# EAGLE design rc (EAGLE 9.1.3)
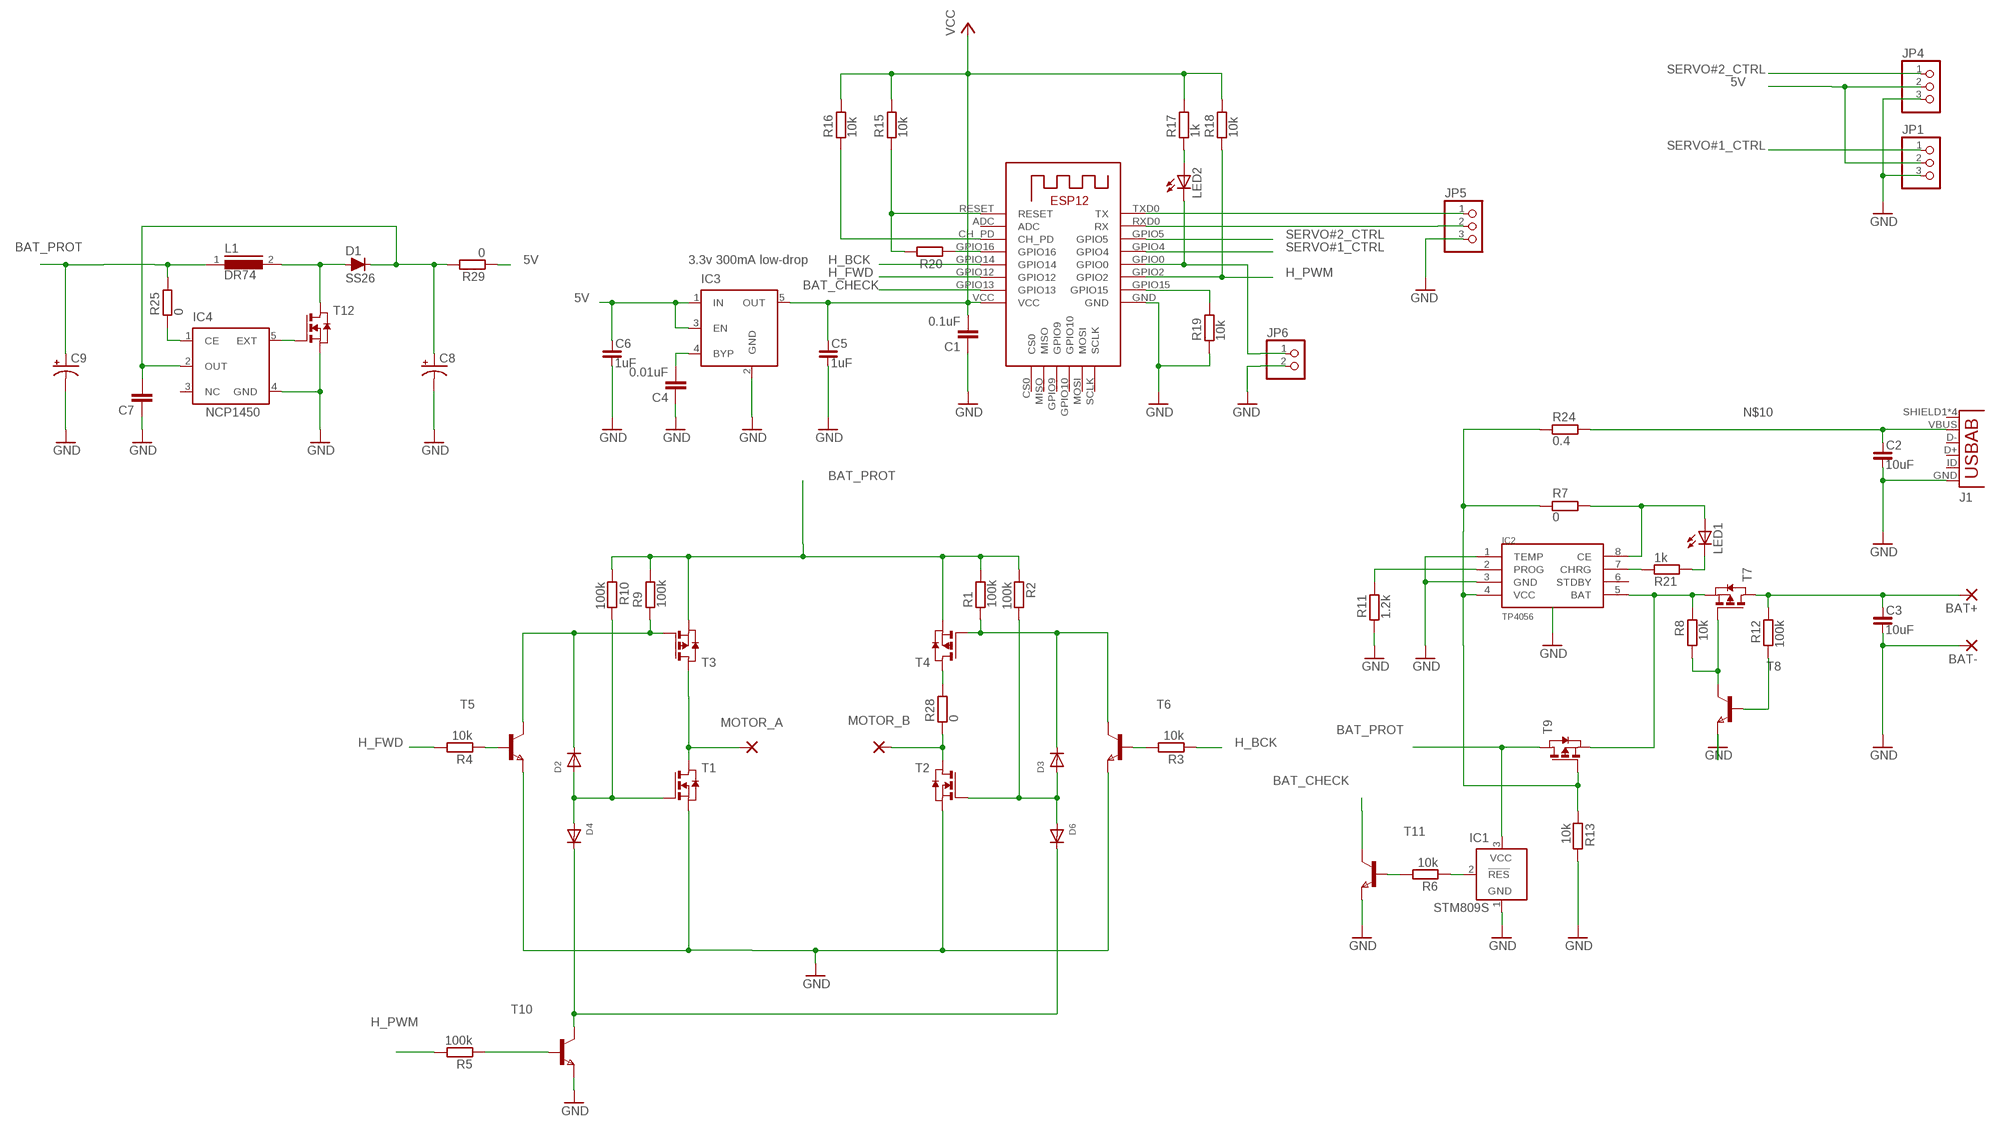
[diagram p0: schematic, sheet 1]

## Parts
BAT+  WIREPADSMD5-2,5  [5-2,5]
BAT-  WIREPADSMD5-2,5  [5-2,5]
C1  0.1uF  C-EUC0805  [C0805]
C2  10uF  C_1206  [C1206]
C3  10uF  C_1206  [C1206]
C4  0.01uF  C-EUC0805  [C0805]
C5  1uF  C_0805  [C0805]
C6  1uF  C_0805  [C0805]
C7  C-EUC0805  [C0805]
C8  CPOL-USCT6032  [CT6032]
C9  CPOL-USCT6032  [CT6032]
D1  SS26  D-FILL-SMB  [SMB]
D2  DIODE_SOD-123FL  [SOD-123FL]
D3  DIODE_SOD-123FL  [SOD-123FL]
D4  DIODE_SOD-123FL  [SOD-123FL]
D6  DIODE_SOD-123FL  [SOD-123FL]
IC1  STM809S  TCM809  [SOT23B-3]
IC2  TP4056  [SOP-8]
IC3  3.3v 300mA low-drop  MIC5219XX  [SOT23-5]
IC4  NCP1450  NCP1450A  [SOT23-5]
J1  USB-AB  [USB-AB-MICRO-SMD]
JP1  PINHD-1X3  [1X03]
JP4  PINHD-1X3  [1X03]
JP5  PINHD-1X3  [1X03]
JP6  PINHD-1X2  [1X02]
L1  DR74  [DR74]
LED1  LEDCHIPLED_0805  [CHIPLED_0805]
LED2  LEDCHIPLED_0805  [CHIPLED_0805]
MOTOR_A  WIREPADSMD5-2,5  [5-2,5]
MOTOR_B  WIREPADSMD5-2,5  [5-2,5]
R1  100k  R_0805  [R0805]
R2  100k  R_08050805  [R0805]
R3  10k  R_0805  [R0805]
R4  10k  R_0805  [R0805]
R5  100k  R_0805  [R0805]
R6  10k  R_0805  [R0805]
R7  0  R_1206  [R1206]
R8  10k  R_0805  [R0805]
R9  100k  R_0805  [R0805]
R10  100k  R_0805  [R0805]
R11  1.2k  R_0805  [R0805]
R12  100k  R_0805  [R0805]
R13  10k  R_0805  [R0805]
R15  10k  R_0805  [R0805]
R16  10k  R_0805  [R0805]
R17  1k  R_0805  [R0805]
R18  10k  R_0805  [R0805]
R19  10k  R_0805  [R0805]
R20  R_0805  [R0805]
R21  1k  R_0805  [R0805]
R24  0.4  R_1206  [R1206]
R25  0  R_1206  [R1206]
R28  0  R_1206  [R1206]
R29  0  R_1206  [R1206]
T1  NMOSSOT23  [SOT-23]
T2  NMOSSOT23  [SOT-23]
T3  PMOSSOT23  [SOT-23]
T4  PMOSSOT23  [SOT-23]
T5  NPNSOT23  [SOT-23]
T6  NPNSOT23  [SOT-23]
T7  PMOSSOT23  [SOT-23]
T8  NPNSOT23  [SOT-23]
T9  PMOSSOT23  [SOT-23]
T10  NPNSOT23  [SOT-23]
T11  NPNSOT23  [SOT-23]
T12  NMOSSOT23  [SOT-23]
U1  ESP-12  [ESP-12]

## Nets
5V: C6.1 IC3.1(IN) IC3.3(EN) JP1.2 JP4.2 R29.1
BAT+: BAT+.1(P) C3.1 R12.1 T7.1(D)
BAT_CHECK: T11.1(C) U1.GPIO13
BAT_CHRG: IC2.5(BAT) R8.1 T7.2(S) T9.2(S)
BAT_PROT: C9.+ IC1.3(VCC) L1.1 R1.2 R2.1 R9.2 R10.1 R25.2 T3.2(S) T4.2(S) T9.1(D)
GND: BAT-.1(P) C1.1 C2.2 C3.2 C4.1 C5.2 C6.2 C7.1 C8.- C9.- IC1.1(GND) IC2.1(TEMP) IC2.3(GND) IC2.HEATSINK IC3.2(GND) IC4.4(GND) J1.GND JP1.3 JP4.3 JP5.3 JP6.2 R11.2 R13.2 R19.1 T1.2(S) T2.2(S) T5.2(E) T6.2(E) T8.2(E) T10.2(E) T11.2(E) T12.2(S) U1.GND
H_BCK: R3.1 U1.GPIO14
H_FWD: R4.2 U1.GPIO12
H_PWM: R5.2 R18.1 U1.GPIO2
N$1: D2.C R9.1 T3.3(G) T5.1(C)
N$2: IC2.8(CE) LED1.A R7.2
N$3: D1.2(A) L1.2 T12.1(D)
N$4: MOTOR_B.1(P) R28.1 T2.1(D)
N$5: R4.1 T5.3(B)
N$6: D2.A D4.A R10.2 T1.3(G)
N$7: R3.2 T6.3(B)
N$8: D3.C R1.1 T4.3(G) T6.1(C)
N$9: D3.A D6.A R2.2 T2.3(G)
N$10: C2.1 J1.VBUS R24.2
N$11: IC2.2(PROG) R11.1
N$12: R8.2 T7.3(G) T8.1(C)
N$13: R6.2 T11.3(B)
N$14: R28.2 T4.1(D)
N$15: IC4.5(EXT) T12.3(G)
N$16: R12.2 T8.3(B)
N$17: IC1.2(!RES) R6.1
N$18: IC4.1(CE) R25.1
N$19: R15.1 R20.2 U1.RESET
N$20: R16.1 U1.CH_PD
N$21: JP6.1 LED2.C U1.GPIO0
N$23: R20.1 U1.GPIO16
N$24: LED2.A R17.1
N$25: C4.2 IC3.4(BYP)
N$26: R19.2 U1.GPIO15
N$27: LED1.C R21.2
N$28: IC2.7(CHRG) R21.1
N$29: C7.2 C8.+ D1.1(C) IC4.2(OUT) R29.2
N$31: D4.C D6.C T10.1(C)
N$32: R5.1 T10.3(B)
N$36: MOTOR_A.1(P) T1.1(D) T3.1(D)
RX: JP5.2 U1.RXD0(RX)
SERVO#1_CTRL: JP1.1 U1.GPIO4
SERVO#2_CTRL: JP4.1 U1.GPIO5
TX: JP5.1 U1.TXD0(TX)
V_CHRG: IC2.4(VCC) R7.1 R13.1 R24.1 T9.3(G)
VCC: C1.2 C5.1 IC3.5(OUT) R15.2 R16.2 R17.2 R18.2 U1.VCC
Unconnected: IC2.6(STDBY) IC4.3(NC) J1.D+ J1.D- J1.ID(USBID) J1.SHIELD1(SHIELD) J1.SHIELD2(SHIELD) J1.SHIELD3(SHIELD) J1.SHIELD4(SHIELD) U1.ADC U1.CS0 U1.GPIO9 U1.GPIO10 U1.MISO U1.MOSI U1.SCLK

## Library data of the parts
BAT+ BAT- MOTOR_A MOTOR_B = wirepad:WIREPAD: Wire PAD connect wire on PCB
C1 C4 C7 = skydrop:C-EU: CAPACITOR, European symbol
C2 C3 C5 C6 = skydrop:C_: NON-POLARIZED CAP
C8 C9 = adafruit:CPOL-US: POLARIZED CAPACITOR, American symbol
D1 = semicon-smd-ipc:D-FILL-: DIODE filled
D2-D4 D6 = skydrop:DIODE: Diode SMADIODE - SMA Surface Mount Package 20V 1A Schottky Diode Digikey: 641-1014-6-ND DO-1N4148 - Through Hole Small Current Diode SOD-123 20V 1 A (.5mV Vf) Schottky Diode - Digikey: MBRX120TPMSCT-ND SOD-323 10V 570mA (.38mV Vf, 3ns) Schottky Diode - Digikey: ZLLS410CT-ND SOD-523 30V 30mA Schottky Diode (RB751S-40TE61) - Digikey: RB751S-40TE61CT-ND SOT23-R/W - SOT23 Package (R = Solder Paste/Reflow Ovens, W = Hand-Soldering) BAT54Film 40V 300mA - Digikey: 497-7162-1-ND
IC1 = skydrop:TCM809: POWER SUPPLY MONITOR replacement for Maxim MAX809 and MAX810; MF: MICROCHIP; MPN: TCM809MENB713; OC_FARNELL: 9762744; OC_NEWARK: 96K3998
IC2 = my:TP4056
IC3 = skydrop:MIC5219XX: VOLTAGE REGULATOR; OC_FARNELL: unknown; OC_NEWARK: unknown
IC4 = my:NCP1450A: VOLTAGE REGULATOR; OC_FARNELL: unknown; OC_NEWARK: unknown
J1 = skydrop:USB-AB: This is a USB AB connector that is compatible with USB OTG. i.e. this connector can serve as a host or device
JP1 JP4 JP5 = my:PINHD-1X3: PIN HEADER
JP6 = my:PINHD-1X2: PIN HEADER
L1 = inductors:DR74: High Power Density, High Efficiency, Shielded Inductors Source: coiltronics_dr_series.pdf; SPICEPREFIX: L
LED1 LED2 = led:LED: LED OSRAM: - CHIPLED LG R971, LG N971, LY N971, LG Q971, LY Q971, LO R971, LY R971 LH N974, LH R974 LS Q976, LO Q976, LY Q976 LO Q996 - Hyper CHIPLED LW Q18S LB Q993, LB Q99A, LB R99A - SideLED LS A670, LO A670, LY A670, LG A670, LP A670 LB A673, LV A673, LT A673, LW A673 LH A674 LY A675 LS A676, LA A676, LO A676, LY A676, LW A676 LS A679, LY A679, LG A679 - Hyper Micro SIDELED® LS Y876, LA Y876, LO Y876, LY Y876 LT Y87S - SmartLED LW L88C, LW L88S LB L89C, LB L89S, LG L890 LS L89K, LO L89K, LY L89K LS L896, LA L896, LO L896, LY L896 - TOPLED LS T670, LO T670, LY T670, LG T670, LP T670 LSG T670, LSP T670, LSY T670, LOP T670, LYG T670 LG T671, LOG T671, LSG T671 LB T673, LV T673, LT T673, LW T673 LH T674 LS T676, LA T676, LO T676, LY T676, LB T676, LH T676, LSB T676, LW T676 LB T67C, LV T67C, LT T67C, LS T67K, LO T67K, LY T67K, LW E67C LS E67B, LA E67B, LO E67B, LY E67B, LB E67C, LV E67C, LT E67C LW T67C LS T679, LY T679, LG T679 LS T770, LO T770, LY T770, LG T770, LP T770 LB T773, LV T773, LT T773, LW T773 LH T774 LS E675, LA E675, LY E675, LS T675 LS T776, LA T776, LO T776, LY T776, LB T776 LHGB T686 LT T68C, LB T68C - Hyper Mini TOPLED® LB M676 - Mini TOPLED Santana® LG M470 LS M47K, LO M47K, LY M47K Source: http://www.osram.convergy.de LUXEON: - LUMILED® LXK2-PW12-R00, LXK2-PW12-S00, LXK2-PW14-U00, LXK2-PW14-V00 LXK2-PM12-R00, LXK2-PM12-S00, LXK2-PM14-U00 LXK2-PE12-Q00, LXK2-PE12-R00, LXK2-PE12-S00, LXK2-PE14-T00, LXK2-PE14-U00 LXK2-PB12-K00, LXK2-PB12-L00, LXK2-PB12-M00, LXK2-PB14-N00, LXK2-PB14-P00, LXK2-PB14-Q00 LXK2-PR12-L00, LXK2-PR12-M00, LXK2-PR14-Q00, LXK2-PR14-R00 LXK2-PD12-Q00, LXK2-PD12-R00, LXK2-PD12-S00 LXK2-PH12-R00, LXK2-PH12-S00 LXK2-PL12-P00, LXK2-PL12-Q00, LXK2-PL12-R00 Source: www.luxeon.com KINGBRIGHT: KA-3528ASYC Source: www.kingbright.com
R1 R3-R13 R15-R21 R24 R25 R28 R29 = skydrop:R_: RESISTOR
R2 = my:R_0805: RESISTOR
T1 T2 T12 = zetex:NMOSSOT23: MOS FET; OC_FARNELL: unknown; OC_NEWARK: unknown
T3 T4 T7 T9 = zetex:PMOSSOT23: MOS FET; OC_FARNELL: unknown; OC_NEWARK: unknown
T5 T6 T8 T10 T11 = zetex:NPNSOT23: NPN TRANSISTOR; MPN: DSS20201L-7; OC_FARNELL: 1710688; OC_NEWARK: 25R4555
U1 = my:ESP-12

## Board
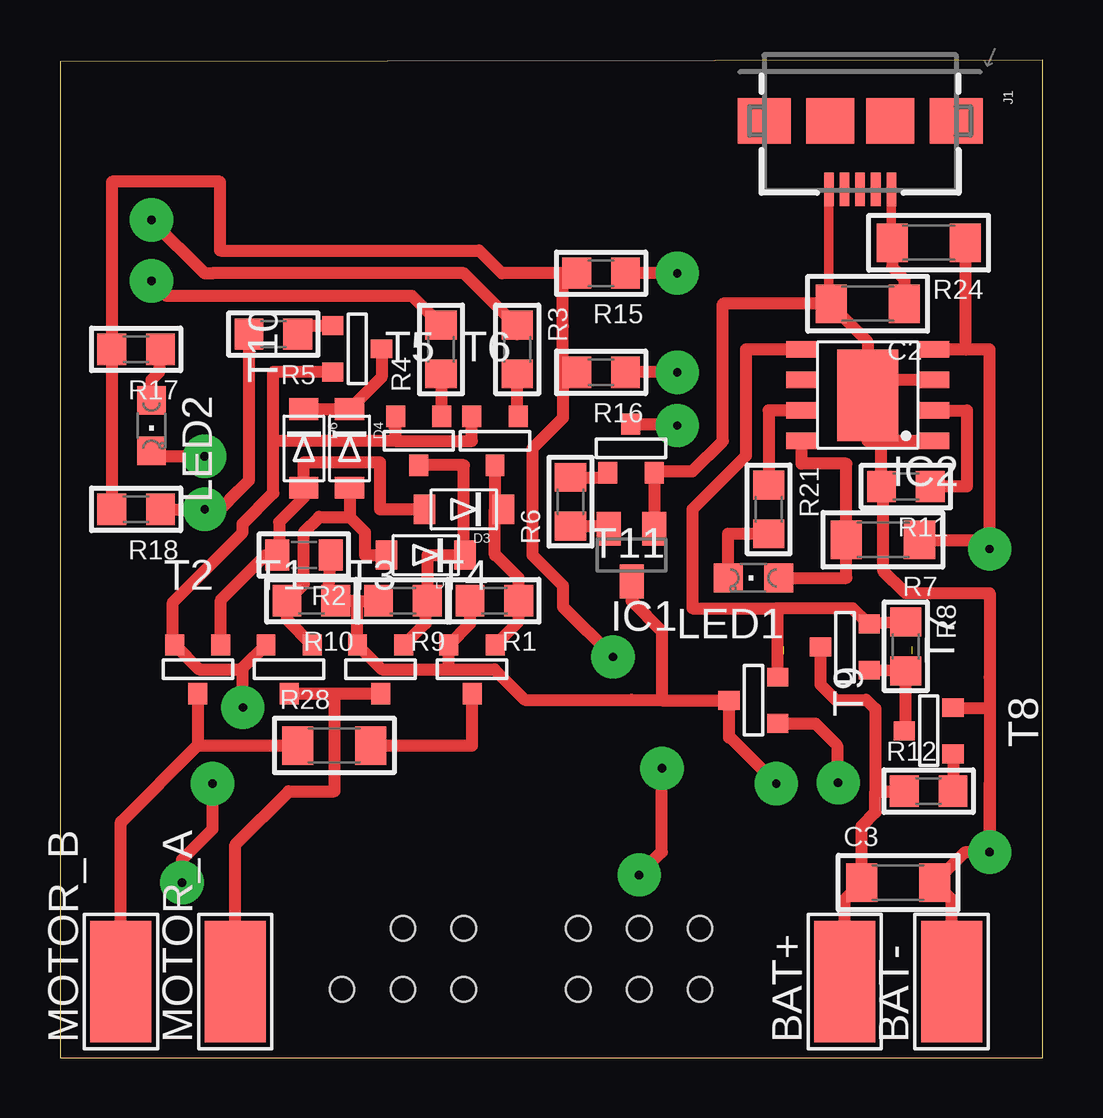
[diagram p1: board, top side]
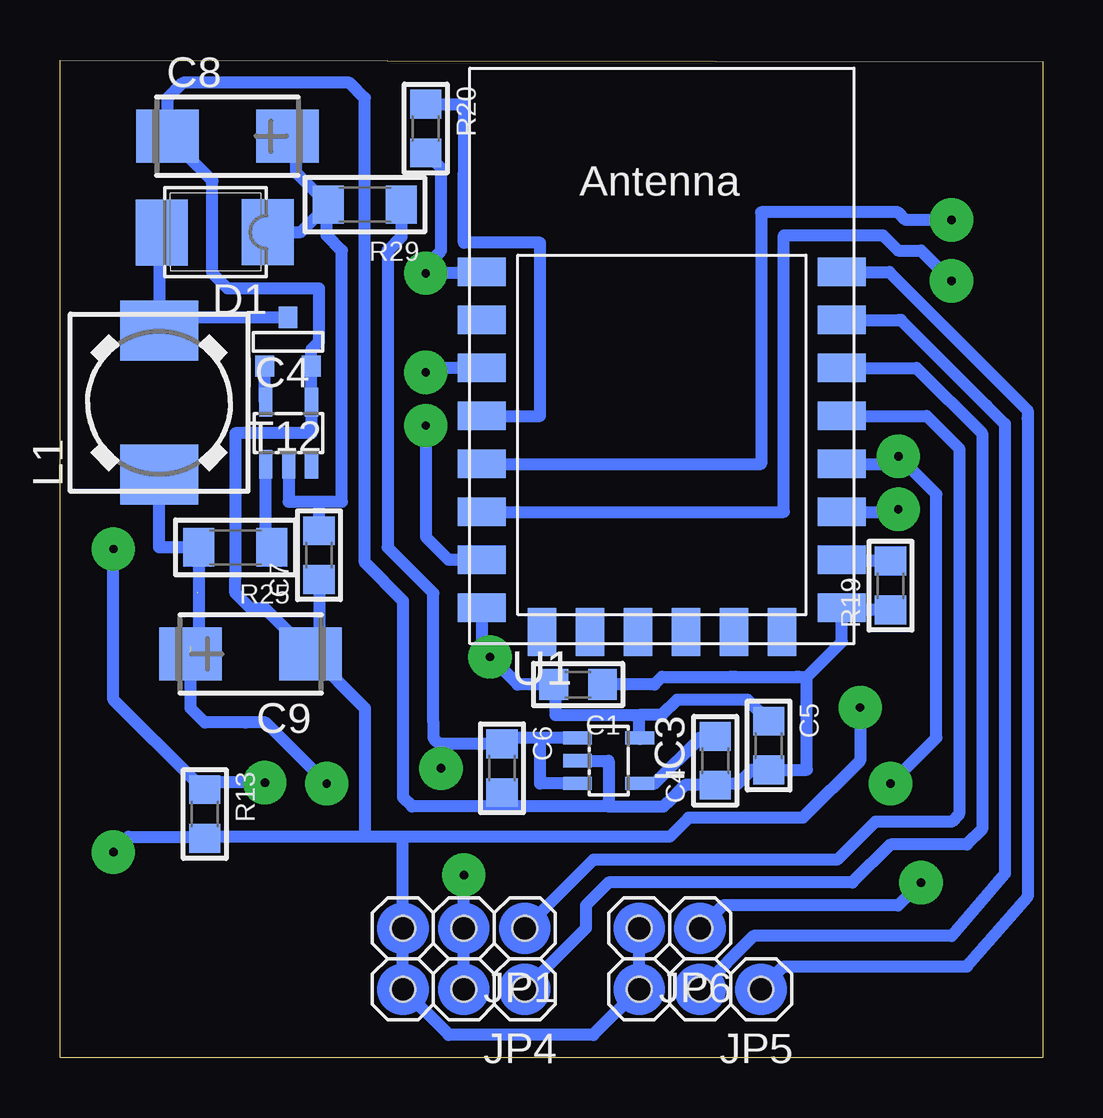
[diagram p2: board, bottom side, seen from below]

Size 40.96 x 41.59 mm. Coordinates in mm from the lower left corner, seen from the top.
Outline: 0,0 40.95,0 40.96,41.59 0,41.53 0,0
Copper layers (1*16): Top 0.035mm / dielectric 1.5mm / Bottom 0.035mm
Design rules "default *": minimum track width 0.4mm, minimum drill 0.35mm, track to track 0.4mm, track to pad 0.4mm, pad to pad 0.4mm, via to via 0.4mm, smd to smd 0.4mm, copper to edge 0.2mm, drill to drill 6mil, minimum pad ring 10mil, minimum via ring 8mil, stop-mask expansion 4mil, vias tented up to drill 0mil, thermal gap 10mil

### Footprints (pad centres in the part's own frame; a part is rotated, then mirrored left to right if it is on the bottom)
5-2,5 = smd 2.54 x 5.08: 1 0,0
C0805 = smd 1.2 x 1.3: 1 -1.016,0; 2 1.016,0
C1206 = smd 1.3 x 1.6: 1 -1.524,0; 2 1.524,0
CT6032 = smd 2.6 x 2.2: + 2.5,0; - -2.5,0
SMB = smd 2.159 x 2.743: 1 -2.311,-0.127; 2 2.108,-0.102
SOD-123FL = smd 0.91 x 1.22: A 1.637,0; C -1.637,0
SOT23B-3 = smd 1 x 1.4: 1 -0.95,-1.1; 2 0.95,-1.1; 3 0,1.1
SOP-8 = smd 1.3 x 0.7: 1 -2.75,1.905; 2 -2.75,0.635; 3 -2.75,-0.635; 4 -2.75,-1.905; 5 2.75,-1.905; 6 2.75,-0.635; 7 2.75,0.635; 8 2.75,1.905 | smd 2.54 x 3.81: HEATSINK 0,0
SOT23-5 = smd 0.55 x 1.2: 1 -0.95,-1.3; 2 0,-1.3; 3 0.95,-1.3; 4 0.95,1.3; 5 -0.95,1.3
USB-AB-MICRO-SMD = smd 1.4 x 0.4: D+ 2.85,0; D- 2.85,0.65; GND 2.85,-1.3; ID 2.85,-0.65; VBUS 2.85,1.3 | smd 1.9 x 2.2: SHIELD1 0,4; SHIELD4 0,-4 | smd 1.9 x 2: SHIELD2 0,1.25; SHIELD3 0,-1.25
1X03 = smd 0.025 x 0.025: 1 -2.54,0; 2 0,0; 3 2.54,0 | hole 1.016: -2.54,0; 0,0; 2.54,0
1X02 = smd 0.025 x 0.025: 1 -1.27,0; 2 1.27,0 | hole 1.016: -1.27,0; 1.27,0
DR74 = smd 2.5 x 3.25: 1 -3,0; 2 3,0
CHIPLED_0805 = smd 1.2 x 1.2: A 0,-1.05; C 0,1.05
R0805 = smd 1.2 x 1.3: 1 -1.016,0; 2 1.016,0
R0805' = smd 1 x 1.3: 1 -1.116,0; 2 1.116,0
R1206 = smd 1.3 x 1.6: 1 -1.524,0; 2 1.524,0
SOT-23 = smd 0.787 x 0.889: 1 0.025,-1.016; 2 -0.94,1.016; 3 0.991,1.016
ESP-12 = smd 2 x 1.2: ADC -7.5,2.5; CH_PD -7.5,0.5; GND 7.5,-9.5; GPIO0 7.5,-3.5; GPIO2 7.5,-5.5; GPIO4 7.5,-1.5; GPIO5 7.5,0.5; GPIO12 -7.5,-5.5; GPIO13 -7.5,-7.5; GPIO14 -7.5,-3.5; GPIO15 7.5,-7.5; GPIO16 -7.5,-1.5; RESET -7.5,4.5; RXD0 7.5,2.5; TXD0 7.5,4.5; VCC -7.5,-9.5 | smd 1.2 x 2: CS0 -5,-10.5; GPIO9 -1,-10.5; GPIO10 1,-10.5; MISO -3,-10.5; MOSI 3,-10.5; SCLK 5,-10.5

### Placement (x,y rotation side)
BAT+  32.7,3.18 0 top
BAT-  37.15,3.18 0 top
C1  19.37,15.56 180 bottom
C2  33.66,31.43 180 top
C3  34.93,7.3 0 top
C4  13.65,12.38 90 bottom
C5  11.43,13.02 270 bottom
C6  22.54,12.06 270 bottom
C7  30.16,20.96 90 bottom
C8  33.97,38.42 0 bottom
C9  33.02,16.83 180 bottom
D1  34.61,34.29 180 bottom
D2  15.24,20.96 180 top
D3  16.83,22.86 180 top
D4  12.06,25.4 270 top
D6  10.16,25.4 270 top
IC1  23.81,20.96 180 top
IC2  33.66,27.62 180 top
IC3  18.1,12.38 270 bottom
IC4  31.43,26.04 0 bottom
J1  33.34,39.05 270 top
JP1  24.13,5.4 180 bottom
JP4  24.13,2.86 180 bottom
JP5  14.29,2.86 180 bottom
JP6  15.56,5.4 180 bottom
L1  36.83,27.3 90 bottom
LED1  28.89,20 90 top
LED2  3.81,26.35 180 top
MOTOR_A  7.3,3.18 0 top
MOTOR_B  2.54,3.18 0 top
R1  18.1,19.05 180 top
R2  100k  [R0805']  10.16,20.96 180 top
R3  19.05,29.53 270 top
R4  15.88,29.53 90 top
R5  8.89,30.16 180 top
R6  21.27,23.18 90 top
R7  34.29,21.59 180 top
R8  35.24,17.14 270 top
R9  14.29,19.05 180 top
R10  10.48,19.05 180 top
R11  35.24,23.81 180 top
R12  36.2,11.11 0 top
R13  34.93,10.16 270 bottom
R15  22.54,32.7 180 top
R16  22.54,28.58 180 top
R17  3.17,29.53 180 top
R18  3.17,22.86 180 top
R19  6.35,19.68 90 bottom
R20  25.72,38.73 270 bottom
R21  29.53,22.86 270 top
R24  36.2,33.97 180 top
R25  33.66,21.27 180 bottom
R28  11.43,13.02 0 top
R29  28.26,35.56 180 bottom
T1  9.53,16.19 0 top
T2  5.71,16.19 0 top
T3  13.33,16.19 0 top
T4  17.14,16.19 0 top
T5  14.92,25.72 0 top
T6  18.1,25.72 0 top
T7  32.7,17.14 270 top
T8  36.2,13.65 270 top
T9  28.89,14.92 270 top
T10  12.38,29.53 90 top
T11  23.81,25.4 180 top
T12  31.43,29.84 180 bottom
U1  15.88,28.26 0 bottom

### Tracks (layer width: path | path; a pad name or v marks a point on that pad's centre or on a via)
5V  (via drill 0.35 pad 1.8)
  Top 0.5: v25.08,12.06 25.08,8.57 v24.13,7.62
  Bottom 0.5: IC3.3 20.96,11.43 20.96,13.33 | IC3.1 20.96,13.33 | 20.96,13.33 20.95,13.33 | R29.1 26.73,34.23 27.3,33.66 27.3,21.27 26.35,20.32 25.4,19.37 25.4,13.97 25.4,13.34 25.08,13.02 | JP4.2 JP1.2 v24.13,7.62 | 25.08,13.02 v25.08,12.06 | 20.96,13.33 22.54,13.33 C6.1 25.08,13.08 25.08,13.02
BAT+
  Top 0.5: C3.1 33.66,7.24 | C3.1 33.66,7.37 | C3.1 33.4,9.65 33.97,10.22 33.97,11.11 | 32.7,1.9 BAT+.1 32.7,6.6 C3.1 | T7.1 31.69,15.56 32.32,14.92 33.59,14.92 33.97,14.54 33.97,11.11 | 33.97,11.11 R12.1
  Top 0.6: C3.1 33.27,7.43
BAT_CHECK  (via drill 0.35 pad 1.8)
  Top 0.5: T11.1 25.65,26.42 v25.72,26.35
  Bottom 0.5: U1.GPIO13 24.77,20.76 25.72,21.71 25.72,25.08 v25.72,26.35
BAT_CHRG
  Top 0.5: R8.1 33.73,18.1 T7.2 33.67,18.08 33.02,18.73 29.85,18.73 | IC2.5 28.58,29.53 28.58,25.08 26.35,22.86 26.35,18.73 29.85,18.73 | T9.2 29.91,18.73 29.85,18.73
BAT_PROT  (via drill 0.35 pad 1.8)  (1 unrouted)
  Top 0.5: 16.21,16.19 T4.2 16.19,17.21 | 12.32,17.21 T3.2 | R1.2 17.08,18.1 16.19,17.21 | 16.13,17.21 16.19,17.21 | T3.2 12.38,17.21 12.38,19.05 | 12.38,19.05 R9.2 | 12.38,19.05 11.75,19.05 | 11.75,19.05 R10.1 | T3.2 13.41,16.19 16.21,16.19 | R2.1 11.18,19.62 11.75,19.05 | 16.21,16.19 18.1,16.19 19.37,14.92 23.81,14.92 25.06,14.92 25.08,14.9 | 25.08,14.9 T9.1 27.88,13.34 27.94,13.34 v29.85,11.43 | IC1.3 23.81,19.05 25.08,17.78 25.08,15.53 25.08,14.9
  Bottom 0.5: 35.52,17.14 36.51,17.14 35.88,17.14 35.18,17.84 R25.2 36.83,21.27 L1.1 | v29.85,11.43 32.38,13.97 33.22,13.97 34.93,13.97 35.52,14.57 C9.+
GND  (via drill 0.35 pad 1.8)  (2 unrouted)
  Top 0.4: J1.GND 32.04,31.53
  Top 0.5: C3.2 36.83,7.24 | 36.2,3.18 BAT-.1 37.15,6.6 C3.2 | T2.2 4.76,17.22 4.76,17.46 | T6.2 17.16,25.72 13.97,25.72 | T2.2 4.7,17.21 4.7,18.99 7.61,21.89 7.61,22.25 8.89,23.54 8.89,25.72 | 7.62,16.19 7.62,14.92 v7.62,14.61 | T2.2 5.79,16.19 7.62,16.19 | T1.2 7.62,16.24 7.62,16.19 | IC2.3 34.29,28.26 33.66,28.26 33.66,27.94 IC2.HEATSINK 33.66,27.3 | IC2.1 34.29,25.72 | 34.29,25.72 33.97,25.72 33.66,25.72 33.66,27.3 | T5.2 13.97,26.72 13.97,26.4 | 13.92,26.35 13.97,26.4 | 13.96,26.42 13.97,26.4 | 13.97,26.4 13.97,25.72 | C2.2 32.13,31.37 33.66,29.84 33.66,27.3 | R11.2 33.97,24.07 | R11.2 34.29,23.75 34.29,20.32 35.2,19.41 35.24,19.41 | T8.2 38.73,14.59 | 35.24,19.37 38.73,19.37 38.73,15.86 38.73,14.59 | v38.73,8.57 37.72,8.57 C3.2 | 32.04,31.53 C2.2 | v38.73,8.57 38.73,11.43 | C2.2 27.62,31.43 27.62,25.72 26.35,24.45 24.75,24.45 T11.2 24.75,22.07 IC1.1 | 38.73,14.59 v38.73,8.57 | T10.2 8.89,28.59 8.89,25.72 | R11.2 34.23,25.72 34.29,25.72 | 13.97,25.72 8.89,25.72
  Bottom 0.5: 30.16,17.14 31.43,17.14 30.8,17.14 30.48,17.14 30.52,17.14 | R19.1 8.38,18.67 | 8.38,18.67 U1.GND | IC3.2 18.1,12.38 18.1,10.48 | C1.1 16.19,15.56 15.88,15.87 13.02,15.87 | 13.02,15.87 10.16,15.87 | 10.16,15.87 9.84,15.87 | 12.82,15.87 13.02,15.87 | 10.28,15.87 10.16,15.87 | 9.84,15.87 8.38,17.34 8.38,18.67 | v7.62,14.61 7.62,12.38 10,10 14.76,10 15.56,9.21 19.69,9.21 23.81,9.21 26.04,9.21 26.67,9.21 | JP6.2 JP5.3 18.73,0.95 24.77,0.95 JP4.3 JP1.3 26.67,9.21 | 18.1,10.48 15.81,10.48 15.68,10.6 14.92,11.37 C4.1 13.59,11.43 12.7,11.43 12.13,12 C5.2 9.84,12 9.84,15.87 | 18.1,10.48 22.54,10.48 | 22.54,10.48 26.29,10.48 26.67,10.86 26.67,19.05 28.26,20.64 28.26,40.01 28.89,40.64 35.84,40.64 36.47,40.01 C8.- 34.61,36.55 34.61,32.7 33.97,32.07 30.16,32.07 30.16,29.84 30.48,29.53 30.48,28.84 T12.2 30.48,28.83 IC4.4 30.48,26.03 31.43,26.03 33.66,26.03 33.66,20 33.66,19.37 33.02,18.73 32.42,18.73 C9.- | C6.2 22.54,10.48 | C7.1 30.16,16.83 C9.- | C9.- 28.26,14.57 28.26,9.21 | 26.67,9.21 28.26,9.21 | v38.73,8.57 38.1,9.21 34.99,9.21 R13.2 34.86,9.21 28.26,9.21
H_BCK  (via drill 0.35 pad 1.8)
  Top 0.5: R3.1 19.05,30.8 | R3.1 19.05,30.16 | R3.1 18.99,30.54 16.83,32.7 6.35,32.7 6.03,32.7 v3.81,34.92
  Bottom 0.5: U1.GPIO14 11.75,24.76 11.75,35.24 6.03,35.24 5.71,34.92 v3.81,34.92
H_FWD  (via drill 0.35 pad 1.8)
  Top 0.5: 16.13,30.54 R4.2 14.67,31.75 4.45,31.75 v3.81,32.38 3.81,32.7
  Bottom 0.5: U1.GPIO12 10.79,22.76 10.79,34.29 6.67,34.29 6.03,33.66 5.08,33.66 v3.81,32.38
H_PWM  (via drill 0.35 pad 1.8)
  Top 0.5: R18.1 v6.03,22.86 6.67,22.86 7.46,23.65 7.87,24.07 R5.2
  Bottom 0.5: U1.GPIO2 6.14,22.76 v6.03,22.86
N$1
  Top 0.5: 14.35,17.21 T3.3 15.24,18.12 15.24,18.99 R9.1 15.3,20.96 D2.C 16.83,21 16.83,24.7 T5.1
N$2
  Top 0.5: IC2.8 30.91,24.77 32.77,24.77 R7.2 32.77,20 LED1.A
N$3
  Bottom 0.5: 36.83,34.28 D1.2 36.83,34.39 L1.2 36.83,30.86 T12.1
N$4
  Top 0.5: T2.1 5.74,13.02 | 5.74,13.02 R28.1 | MOTOR_B.1 2.54,9.84 2.56,9.84 5.74,13.02
N$5
  Top 0.5: R4.1 15.91,28.47 T5.3
N$6
  Top 0.5: 10.54,17.23 T1.3 9.46,18.26 R10.2 10.16,19.75 10.16,21.91 10.79,22.54 12.06,22.54 | 12.38,23.76 D4.A 12.06,22.54 | D2.A 12.7,20.96 12.7,21.91 12.06,22.54
N$7
  Top 0.5: T6.3 19.05,26.77 R3.2
N$8
  Top 0.5: 18.16,17.21 T4.3 19.11,18.19 R1.1 19.11,20 18.16,20.96 18.12,20.96 18.12,22.86 | T6.1 18.12,22.86 | 18.12,22.86 D3.C
N$9
  Top 0.5: 6.71,17.36 T2.3 6.71,19.09 8.57,20.96 R2.2 9.13,21.04 9.13,22.32 10.16,23.36 D6.A 10.16,24.83 13.33,24.83 13.33,22.86 D3.A
N$10
  Top 0.4: J1.VBUS 34.64,34.01 R24.2
  Top 0.5: 34.64,34.01 R24.2 34.67,32.96 35.18,32.45 C2.1
N$11
  Top 0.5: IC2.2 37.78,26.99 37.78,23.81 37.47,23.81 R11.1
N$12
  Top 0.5: T8.1 35.24,13.69 R8.2 T7.3
N$13
  Top 0.5: R6.2 22.63,24.19 T11.3
N$14
  Top 0.5: R28.2 16.83,13.02 17.17,13.02 T4.1
N$15
  Bottom 0.5: IC4.5 32.42,27.34 T12.3
N$16
  Top 0.5: 37.19,12.64 T8.3 R12.2
N$17
  Top 0.5: R6.1 22.76,22.16 IC1.2
N$18
  Bottom 0.5: IC4.1 32.38,21.53 R25.1
N$19  (via drill 0.35 pad 1.8)
  Top 0.5: v25.72,32.7 R15.1
  Bottom 0.5: U1.RESET 23.43,32.7 v25.72,32.7 25.72,33.02 25.08,33.66 25.08,37.08 R20.2
N$20  (via drill 0.35 pad 1.8)
  Top 0.5: v25.72,28.58 R16.1
  Bottom 0.5: R16.1 U1.CH_PD 25.54,28.76 v25.72,28.58
N$21  (via drill 0.35 pad 1.8)
  Top 0.5: v6.03,25.07 v6.02,25.08 4.03,25.08 LED2.C | v5.08,7.3 5.08,8.26 6.35,9.53 v6.35,11.43
  Bottom 0.5: U1.GPIO0 8.82,25.08 | U1.GPIO0 8.06,25.07 | U1.GPIO0 6.34,24.76 v6.03,25.07 4.45,23.5 4.45,13.34 v6.35,11.43 | JP6.1 13.33,6.35 6.03,6.35 v5.08,7.3
N$23
  Bottom 0.5: U1.GPIO16 20.96,26.76 20.96,33.97 24.13,33.97 24.13,36.89 24.13,39.75 R20.1
N$24
  Top 0.5: R17.1 4.13,29.46 4.13,28.58 3.81,28.26 LED2.A
N$25
  Bottom 0.5: IC3.4 16.51,11.43 16.19,11.43 14.29,13.34 13.72,13.34 C4.2 13.91,13.4
N$26
  Bottom 0.5: R19.2 8.38,20.7 U1.GPIO15
N$27
  Top 0.5: LED1.C 27.84,21.84 R21.2
N$28
  Top 0.5: 29.53,24.13 R21.1 29.53,26.99 IC2.7
N$29
  Bottom 0.5: IC4.2 31.43,23.18 30.16,23.18 | 29.85,35.5 R29.2 31.12,36.89 31.12,38.06 C8.+ | C7.2 30.16,23.18 | 30.16,23.18 29.85,23.18 29.21,23.18 29.21,33.66 29.85,34.29 29.85,35.5 | D1.1 30.93,34.42 29.85,35.5
N$31
  Top 0.5: 9.84,27.04 D6.C D4.C 13.4,28.37 T10.1
N$32
  Top 0.5: 9.91,30.1 R5.1 10.26,30.52 T10.3
N$36
  Top 0.5: 11.43,15.18 T1.1 9.53,15.15 | 11.43,15.18 T3.1 | 11.43,15.18 11.43,11.11 9.53,11.11 7.3,8.89 MOTOR_A.1
RX
  Bottom 0.4: 5.99,30.76 5.92,30.76 | 1.59,26.42 1.59,26.33
  Bottom 0.5: U1.RXD0 5.99,30.76 | 1.59,26.33 1.59,7.67 3.81,5.08 12.06,5.08 JP5.2 | 5.92,30.76 2.35,27.19 1.59,26.42
SERVO#1_CTRL
  Bottom 0.5: U1.GPIO4 4.85,26.76 3.49,25.4 3.49,10.16 3.81,9.84 6.99,9.84 8.57,8.26 18.73,8.26 JP1.1
SERVO#2_CTRL
  Bottom 0.5: U1.GPIO5 5.26,28.76 2.54,26.03 2.54,9.53 3.17,8.89 6.35,8.89 7.94,7.3 18.1,7.3 19.05,6.35 19.05,5.4 JP4.1
TX
  Bottom 0.5: U1.TXD0 6.41,32.76 0.64,26.99 0.64,26.65 0.64,6.71 3.17,3.81 10.79,3.81 JP5.1
V_CHRG  (via drill 0.35 pad 1.8)
  Top 0.5: 37.78,29.53 38.42,29.53 38.73,29.53 v38.73,21.21 38.73,21.59 R7.1 35.88,21.53 | 37.78,29.53 IC2.4 | 38.04,33.97 R24.1 37.72,29.53 37.78,29.53 | T9.3 31.47,13.93 32.38,13.02 32.38,11.51 v32.42,11.47
  Bottom 0.5: v38.73,21.21 38.73,14.92 35.28,11.47 34.93,11.47 | v32.42,11.47 34.93,11.47 | R13.1 34.93,11.47
VCC  (via drill 0.35 pad 1.8)
  Top 0.5: 20.96,28.58 20.96,30.48 20.96,32.7 R15.2 18.42,32.7 17.46,33.66 6.67,33.66 6.67,36.51 2.16,36.51 R17.2 R18.2 | R16.2 20.96,28.58 | 20.96,28.58 20.96,26.67 19.69,25.4 19.69,20.96 20.96,19.68 20.96,18.8 v23.04,16.71
  Bottom 0.5: IC3.5 16.83,13.36 16.83,14.29 | U1.VCC 23.38,17.04 v23.04,16.71 21.89,15.56 C1.2 20.32,15.49 20.32,14.29 18.1,14.29 16.83,14.29 | 16.83,14.29 15.88,14.29 15.24,14.92 12.32,14.92 C5.1
  Bottom 0.6: 16.8,13.37 IC3.5